# EAGLE design 00B-002 (EAGLE 9.6.2)
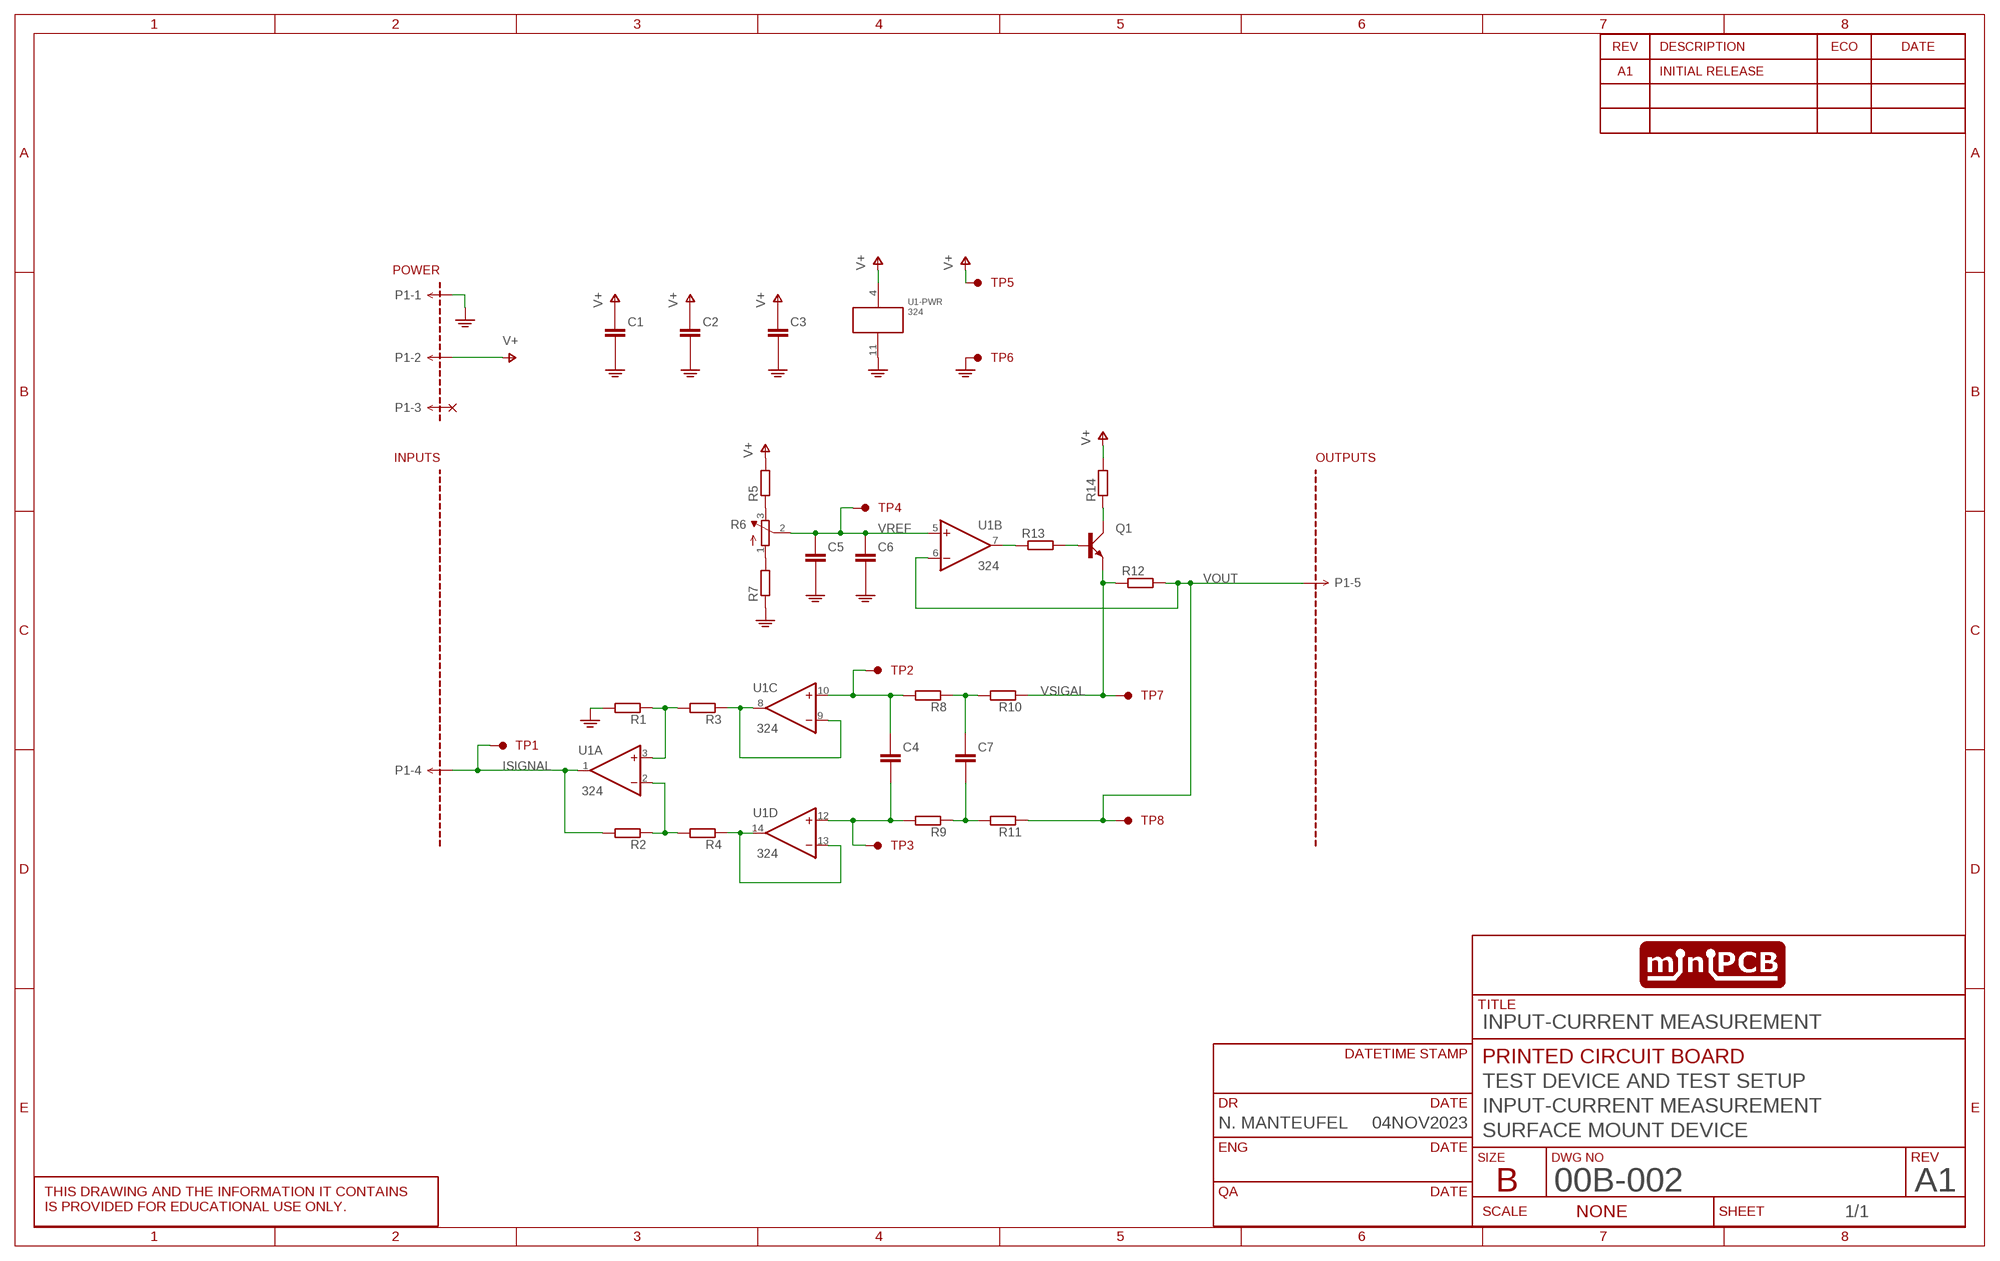
[diagram p0: schematic, sheet 1]
SHEET1 (SCHEMATIC): CIRCUIT_CATEGORY: TEST DEVICE AND TEST SETUP; CIRCUIT_NAME: INPUT-CURRENT MEASUREMENT; CIRCUIT_VARIANT: SURFACE MOUNT DEVICE; DR: N. MANTEUFEL; DR_DATE: 04NOV2023; PCB_PCBA: PRINTED CIRCUIT BOARD; REVA: A1; REVISION: A1; TITLE: INPUT-CURRENT MEASUREMENT

## Parts
C1  1u  CAPACITOR_10  [C5MM]
C2  1u  CAPACITORSMD  [C0805]
C3  1u  CAPACITORSMD  [C0805]
C4  CAPACITORSMD  [C0805]
C5  CAPACITORSMD  [C0805]
C6  CAPACITOR_10  [C5MM]
C7  CAPACITORSMD  [C0805]
P1  MINIPCB_5P5P  [PINS_1X5]
PCB1  MINIPCB_0P33X50  [MINIPCB_0P_33X50]
Q1  BJT_NPNBCE  [SOT223]
R1  RESISTORSMD  [R0805]
R2  RESISTORSMD  [R0805]
R3  RESISTORSMD  [R0805]
R4  RESISTORSMD  [R0805]
R5  RESISTORSMD  [R0805]
R6  TRIMPOT0.100THD  [TRIM_0100]
R7  RESISTORSMD  [R0805]
R8  RESISTORSMD  [R0805]
R9  RESISTORSMD  [R0805]
R10  RESISTORSMD  [R0805]
R11  RESISTORSMD  [R0805]
R12  RESISTORSMD  [R0805]
R13  RESISTORSMD  [R0805]
R14  RESISTORSMD  [R0805]
TP1  TESTPOINTKE5000-SMTEXT  [PINS_1_TESTPOINT_KE5000_NOTEXT]
TP2  TESTPOINTKE5000-SMTEXT  [PINS_1_TESTPOINT_KE5000_NOTEXT]
TP3  TESTPOINTKE5000-SMTEXT  [PINS_1_TESTPOINT_KE5000_NOTEXT]
TP4  TESTPOINTKE5000-SMTEXT  [PINS_1_TESTPOINT_KE5000_NOTEXT]
TP5  TESTPOINTKE5000-SMTEXT  [PINS_1_TESTPOINT_KE5000_NOTEXT]
TP6  TESTPOINTKE5000-SMTEXT  [PINS_1_TESTPOINT_KE5000_NOTEXT]
TP7  TESTPOINTKE5000-SMTEXT  [PINS_1_TESTPOINT_KE5000_NOTEXT]
TP8  TESTPOINTKE5000-SMTEXT  [PINS_1_TESTPOINT_KE5000_NOTEXT]
U1  324  OPAMP_QUADSMD  [SO14]

## Nets
GND: C1.- C2.2(-) C3.2(-) C5.2(-) C6.- P1.1 R1.2 R7.1 TP6.1 U1.11(-PWR:V-)
ISIGNAL: P1.4 R2.2 TP1.1 U1.1(A:OUT)
N$1: Q1.2(C) Q1.4.TAB(C) R14.1
N$2: R3.1 U1.8(C:OUT) U1.9(C:-IN)
N$3: R4.1 U1.13(D:-IN) U1.14(D:OUT)
N$4: Q1.1(B) R13.2
N$5: R6.1(A) R7.2
N$6: R5.1 R6.3(E)
N$7: R13.1 U1.7(B:OUT)
N$8: R2.1 R4.2 U1.2(A:-IN)
N$9: R1.1 R3.2 U1.3(A:+IN)
N$14: C4.1(+) R8.2 TP2.1 U1.10(C:+IN)
N$15: C4.2(-) R9.2 TP3.1 U1.12(D:+IN)
N$16: C7.1(+) R8.1 R10.2
N$17: C7.2(-) R9.1 R11.2
V+: C1.+ C2.1(+) C3.1(+) P1.2 R5.2 R14.2 TP5.1 U1.4(-PWR:V+)
VOUT: P1.5 R11.1 R12.2 TP8.1 U1.6(B:-IN)
VREF: C5.1(+) C6.+ R6.2(S) TP4.1 U1.5(B:+IN)
VSIGAL: Q1.3(E) R10.1 R12.1 TP7.1
Unconnected: P1.3

## Library data of the parts
C1-C7 = minipcb:CAPACITOR
P1 = minipcb:MINIPCB_5P
PCB1 = minipcb:MINIPCB_0P; PART_NUMBER: 00B-002; REVISION: A1-01; TITLE: QUIESCENT CURRENT AMPLIFIER
Q1 = minipcb:BJT_NPN: TRANSISTOR
R1-R5 R7-R14 = minipcb:RESISTOR
R6 = minipcb:TRIMPOT: SMT trimmer potentiometer part number TC33X http://www.ladyada.net/library/eagle
TP1-TP8 = minipcb:TESTPOINT
U1 = minipcb:OPAMP_QUAD: OP AMP

## Board
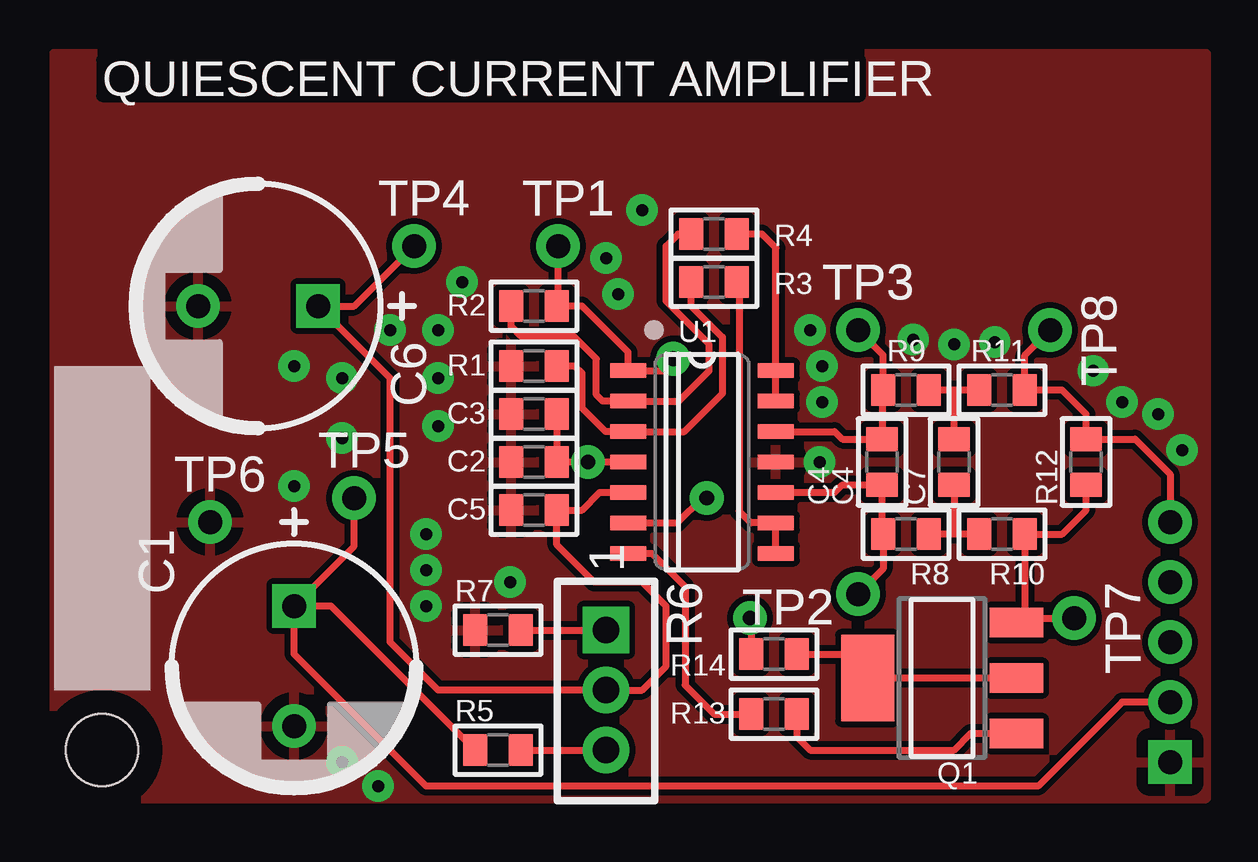
[diagram p1: board, top side]
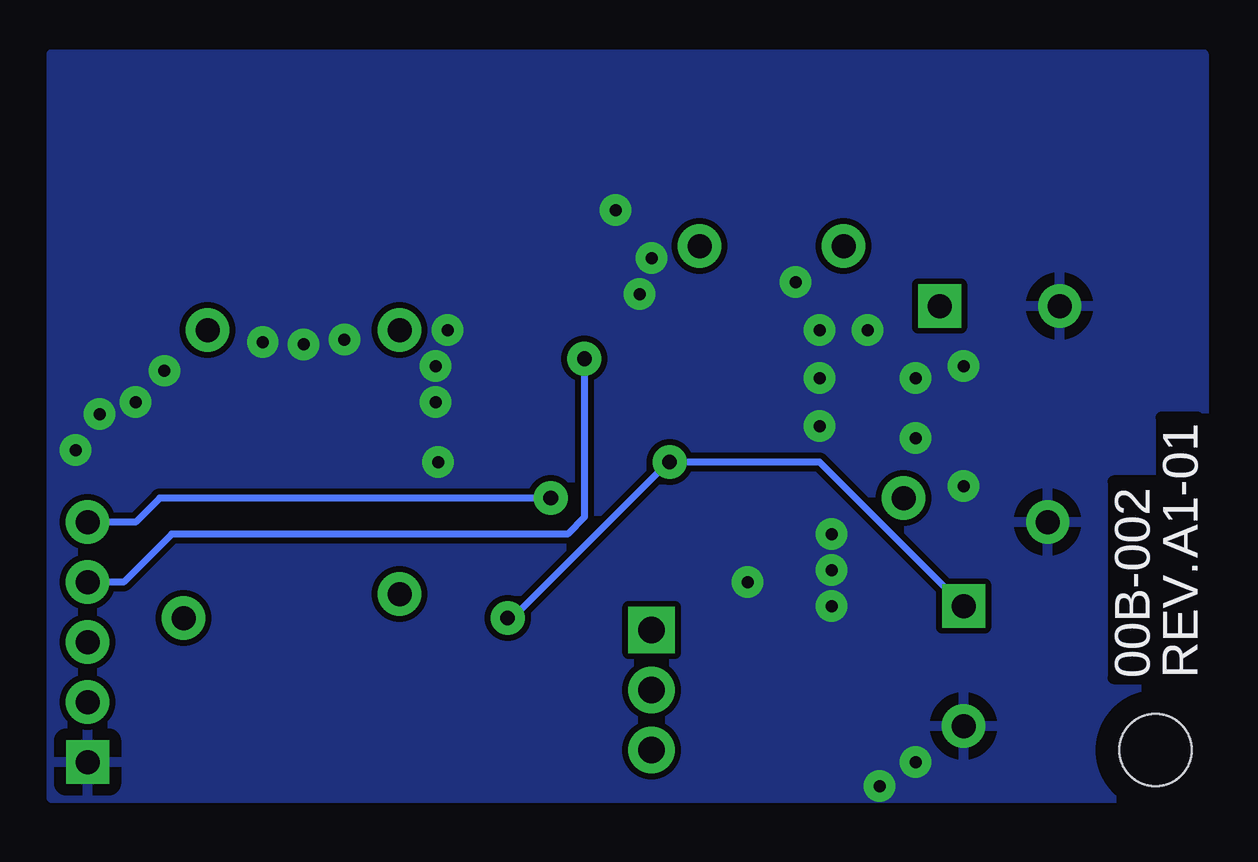
[diagram p2: board, bottom side, seen from below]

No outline drawn. Coordinates in mm, seen from the top.
Copper layers (1*16): Top 0.035mm / dielectric 1.5mm / Bottom 0.035mm
Design rules "minipcb": minimum track width 0.2mm, minimum drill 0.5mm, track to track 0.25mm, track to pad 0.5mm, pad to pad 0.5mm, via to via 0.5mm, smd to smd 0.15mm, copper to edge 1mm, drill to drill 1mm, minimum pad ring 0.4mm, minimum via ring 0.4mm, stop-mask expansion 0.1mm, vias tented up to drill 0.6mm, thermal gap 0.5mm

### Footprints (pad centres in the part's own frame; a part is rotated, then mirrored left to right if it is on the bottom)
C5MM = drill 1 square: + -2.5,0 | drill 1: - 2.5,0
C0805 = smd 1 x 1.3: 1 -0.95,0; 2 0.95,0
PINS_1X5 = drill 1 square: 1 0,0 | drill 1: 2 2.5,0; 3 5,0; 4 7.5,0; 5 10,0
MINIPCB_0P_33X50 = hole 3: 3,3
SOT223 = smd 1.219 x 2.235: 1 -2.311,-3.099; 2 0,-3.099; 3 2.311,-3.099 | smd 3.6 x 2.2: 4.TAB 0,3.099
R0805 = smd 1 x 1.3: 1 -0.95,0; 2 0.95,0
TRIM_0100 = drill 1.1 pad 1.93 square: 1 0,0 | drill 1.1 pad 1.93: 2 2.5,0; 3 5,0
PINS_1_TESTPOINT_KE5000_NOTEXT = drill 1: 1 0,0
SO14 = smd 0.6 x 1.5: 1 -3.81,-3.073; 2 -2.54,-3.073; 3 -1.27,-3.073; 4 0,-3.073; 5 1.27,-3.073; 6 2.54,-3.073; 7 3.81,-3.073; 8 3.81,3.073; 9 2.54,3.073; 10 1.27,3.073; 11 0,3.073; 12 -1.27,3.073; 13 -2.54,3.073; 14 -3.81,3.073

### Placement (x,y rotation side)
C1  11,6.5 270 top
C2  21,15 180 top
C3  21,17 180 top
C4  35.5,15 90 top
C5  21,13 180 top
C6  9.5,21.5 180 top
C7  38.5,15 90 top
P1  47.5,2.5 90 top
PCB1  0,0 0 top
Q1  38,6 90 top
R1  21,19 180 top
R2  21,21.5 0 top
R3  28.5,22.5 180 top
R4  28.5,24.5 180 top
R5  19.5,3 180 top
R6  24,8 270 top
R7  19.5,8 0 top
R8  36.5,12 180 top
R9  36.5,18 180 top
R10  40.5,12 180 top
R11  40.5,18 180 top
R12  44,15 90 top
R13  31,4.5 0 top
R14  31,7 180 top
TP1  22,24 0 top
TP2  34.5,9.5 180 top
TP3  34.5,20.5 0 top
TP4  16,24 0 top
TP5  13.5,13.5 0 top
TP6  7.5,12.5 0 top
TP7  43.5,8.5 270 top
TP8  42.5,20.5 270 top
U1  28,15 270 top

### Tracks (layer width: path | path; a pad name or v marks a point on that pad's centre or on a via)
GND  (via drill 0.5)
  other vias: 32.9,15 20,10 16.5,9 16.5,10.5 16.5,12 17,16.5 17,18.5 11,19 13,18.5 13,16 11,14 18,22.5 17,20.5 15,20.5 24,23.5 24.5,22 25.5,25.5 33,17.5 33,19 32.5,20.5 36.8,20.1 38.5,19.9 40.2,20 44.3,18.8 45.5,17.5 47,17 48,15.5 14.5,1.5 13,2.5
  pour Top: 1,1 49,1 49,32 1,32
  pour Bottom: 1,1 49,1 49,32 1,32
ISIGNAL  (via drill 0.61)
  Top 0.3: TP1.1 22,21.55 R2.2 23,21.5 24.93,19.57 U1.1 26.41,18.81 26.8,19.2 v26.8,19.3
  Bottom 0.3: v26.8,19.3 26.8,12.7 27.5,12 44,12 46,10 P1.4
N$1
  Top 0.3: R14.1 34.5,7 35,6.5 35,6.1 Q1.4.TAB Q1.2
N$2
  Top 0.3: U1.8 U1.9 30.04,12.46 29.55,12.95 29.55,22.4 R3.1
N$3
  Top 0.3: R4.1 30.5,24.5 31.07,23.93 U1.14 U1.13
N$4
  Top 0.3: R13.2 31.95,3.55 32.5,3 38.5,3 39.19,3.69 Q1.1
N$5
  Top 0.3: R7.2 R6.1
N$6
  Top 0.3: R5.1 R6.3
N$7
  Top 0.3: U1.7 25.91,11.19 27.3,9.8 27.3,5.7 28.5,4.5 R13.1
N$8
  Top 0.3: R2.1 20.05,20.65 20.45,20.25 22.65,20.25 23.6,19.3 23.6,17.8 23.86,17.54 U1.2 27.04,17.54 28.3,18.8 28.3,19.9 26.5,21.7 26.5,24 27,24.5 R4.2
N$9
  Top 0.3: R1.1 22.7,19 23,18.7 23,17.25 23.98,16.27 U1.3 27.27,16.27 28.85,17.85 28.85,20.2 27.55,21.5 R3.2
N$14
  Top 0.3: TP2.1 35.55,10.55 R8.2 35.5,12.05 C4.1 33.85,14.05 33.53,13.73 U1.10
N$15
  Top 0.3: TP3.1 35.55,19.45 R9.2 35.5,17.95 C4.2 33.85,15.95 33.53,16.27 U1.12
N$16
  Top 0.3: R10.2 38.5,12 | 38.5,12 R8.1 | C7.1 38.5,12
N$17
  Top 0.3: R11.2 38.5,18 | 38.5,18 R9.1 | C7.2 38.5,18
V+  (via drill 0.61)
  Top 0.3: R5.2 12.55,9 C1.+ | C1.+ 13.5,11.5 TP5.1 | U1.4 v23.25,15 C2.1 C3.1 | v30,8.5 30.05,8.45 R14.2 | P1.2 45.5,5 42,1.5 16.5,1.5 11,7 C1.+
  Bottom 0.3: C1.+ 17,15 v23.25,15 23.3,15 29.8,8.5 v30,8.5
VOUT  (via drill 0.61)
  Top 0.3: TP8.1 41.45,19.45 R11.1 43,18 44,17 R12.2 46.05,15.95 47.5,14.5 P1.5 | U1.6 26.96,12.46 28,13.5 v28.2,13.5
  Bottom 0.3: v28.2,13.5 44.5,13.5 45.5,12.5 P1.5
VREF
  Top 0.3: TP4.1 13.5,21.5 C6.+ 15,18.5 15,7.5 17,5.5 R6.2 25.5,5.5 26.5,6.5 26.5,9 25.5,10 23.5,10 21.95,11.55 C5.1 23,13 23.73,13.73 U1.5
VSIGAL
  Top 0.3: R12.1 44,13 43,12 R10.1 41.45,8.66 Q1.3 41.29,8.5 TP7.1

### Text on the board
_tNames: TP4 | TP1 | R4 | R2 | R3 | TP3 | TP8 | C6 | R1 | U1 | R9 | R11 | C3 | TP5 | C2 | TP6 | C5 | C4 | C7 | R12 | R8 | R10 | C1 | R6 | TP2 | TP7 | R7 | R14 | R13 | R5 | Q1